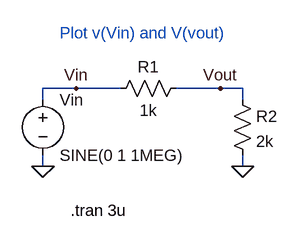
[diagram p0: schematic Fig1_26_old.asc]
Fig1_26_old.asc, the LTspice schematic file:
Version 4
SHEET 1 1048 680
WIRE 0 240 0 224
WIRE 0 336 0 320
WIRE 48 224 0 224
WIRE 112 224 48 224
WIRE 256 224 192 224
WIRE 288 224 256 224
WIRE 288 240 288 224
WIRE 288 336 288 320
FLAG 0 336 0
FLAG 288 336 0
FLAG 256 224 Vout
FLAG 48 224 Vin
SYMBOL voltage 0 224 R0
WINDOW 123 0 0 Left 0
WINDOW 39 0 0 Left 0
SYMATTR InstName Vin
SYMATTR Value SINE(0 1 1MEG)
SYMBOL res 96 240 R270
WINDOW 0 32 56 VTop 0
WINDOW 3 0 56 VBottom 0
SYMATTR InstName R1
SYMATTR Value 1k
SYMBOL res 272 224 R0
SYMATTR InstName R2
SYMATTR Value 2k
TEXT 40 400 Left 0 !.tran 3u
TEXT 24 144 Left 0 ;Plot v(Vin) and V(vout)

The netlist it stands for:
* Fig1_26_old.asc
Vin Vin 0 SINE(0 1 1MEG)
R1 Vin Vout 1k
R2 Vout 0 2k
.tran 3u
* Plot v(Vin) and V(vout)
.backanno
.end